# Altium schematic sheet SiP.SchDoc: Magic Baton: SiP
size Letter
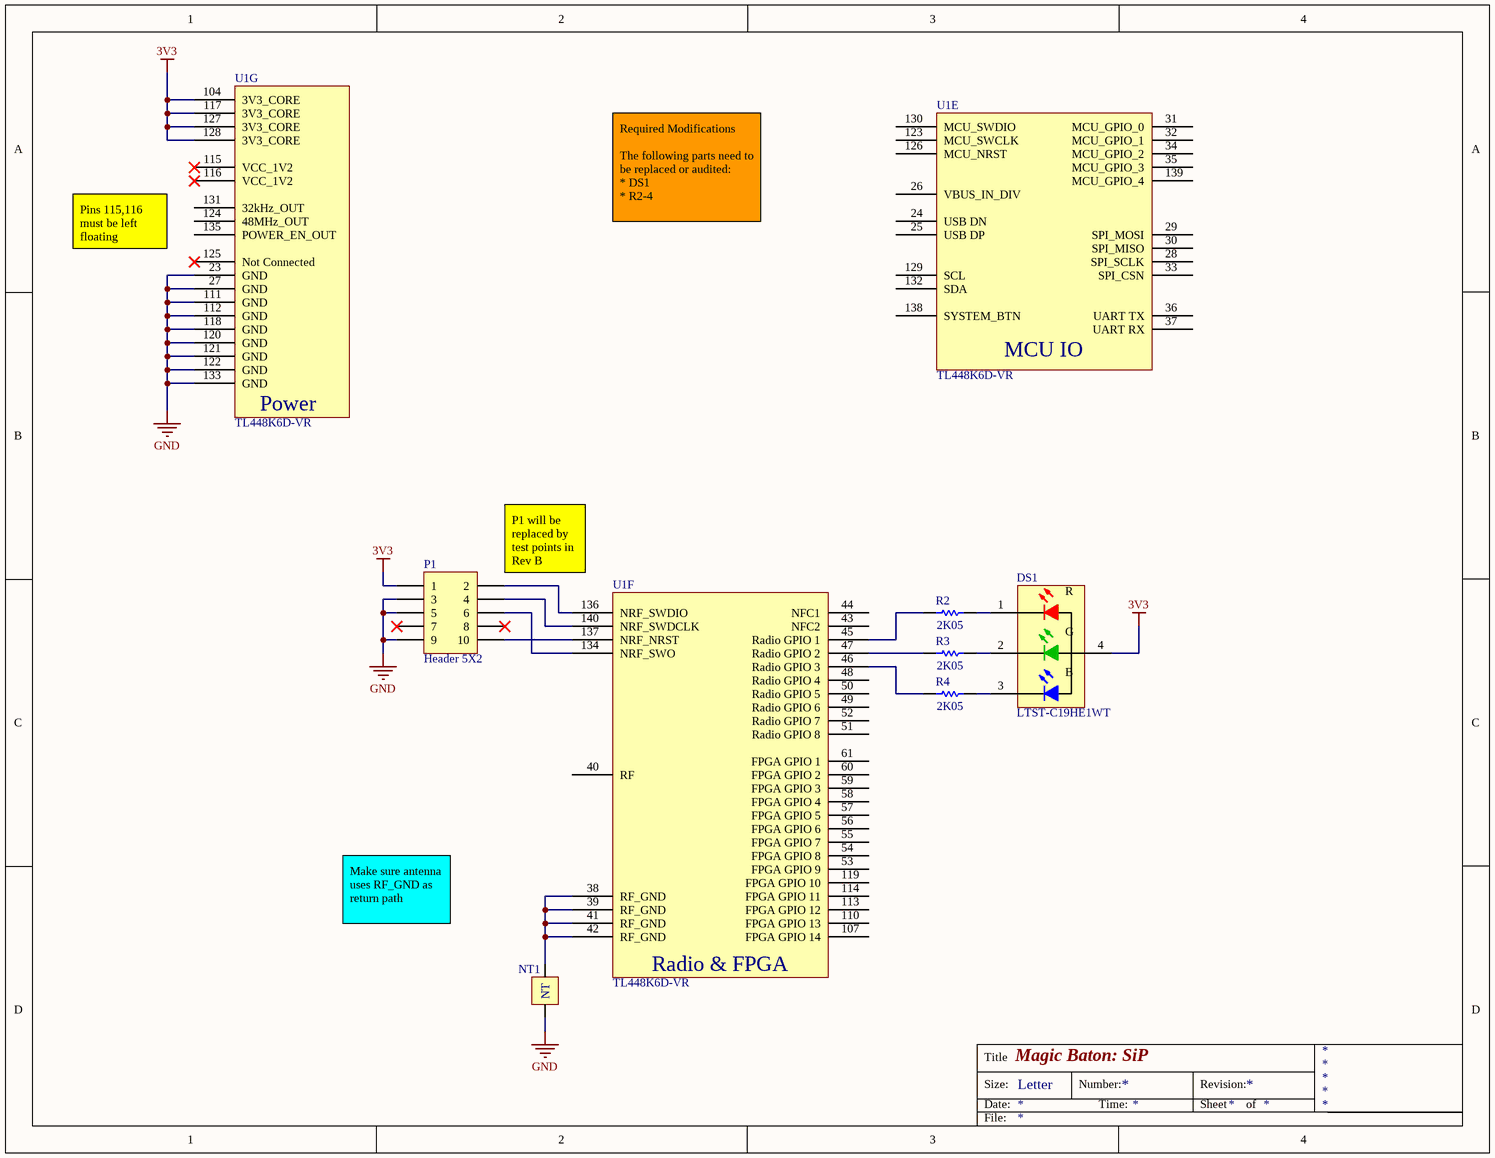
[diagram p0: SiP.SchDoc]

## Parts
DS1  LTST-C19HE1WT  [LTST-C19HE1WT-4_V]
NT1  NT1  (value not drawn)  (net tie, no BOM)
P1  Header 5X2  [HDR2X5]
R2  value 2K05  [AXIAL-0.3]  (hidden comment: Res1)
R3  value 2K05  [AXIAL-0.3]  (hidden comment: Res1)
R4  value 2K05  [AXIAL-0.3]  (hidden comment: Res1)
U1  TL448K6D-VR  [WatchmanModule_v4]  (parts E,F,G of 7)

## Nets
3V3: DS1.4(A) P1.1 U1.104(3V3_CORE) U1.117(3V3_CORE) U1.127(3V3_CORE) U1.128(3V3_CORE)
GND: NT1.1 P1.3 P1.5 P1.9 U1.23(GND) U1.27(GND) U1.111(GND) U1.112(GND) U1.118(GND) U1.120(GND) U1.121(GND) U1.122(GND) U1.133(GND)
NetDS1_1: DS1.1(R) R2.2
NetDS1_2: DS1.2(G) R3.2
NetDS1_3: DS1.3(B) R4.2
NetNT1_2: NT1.2 U1.38(RF_GND) U1.39(RF_GND) U1.41(RF_GND) U1.42(RF_GND)
NetP1_2: P1.2 U1.136(NRF_SWDIO)
NetP1_4: P1.4 U1.140(NRF_SWDCLK)
NetP1_6: P1.6 U1.134(NRF_SWO)
NetP1_10: P1.10 U1.137(NRF_NRST)
NetR2_1: R2.1 U1.45(Radio_GPIO_1)
NetR3_1: R3.1 U1.47(Radio_GPIO_2)
NetR4_1: R4.1 U1.46(Radio_GPIO_3)

Not connected (* = marked no-connect by the designer): P1 7* 8*; U1 24(USB_DN) 25(USB_DP) 26(VBUS_IN_DIV) 28(SPI_SCLK) 29(SPI_MOSI) 30(SPI_MISO) 31(MCU_GPIO_0) 32(MCU_GPIO_1) 33(SPI_CSN) 34(MCU_GPIO_2) 35(MCU_GPIO_3) 36(UART_TX) 37(UART_RX) 40(RF) 43(NFC2) 44(NFC1) 48(Radio_GPIO_4) 49(Radio_GPIO_6) 50(Radio_GPIO_5) 51(Radio_GPIO_8) 52(Radio_GPIO_7) 53(FPGA_GPIO_9) 54(FPGA_GPIO_8) 55(FPGA_GPIO_7) 56(FPGA_GPIO_6) 57(FPGA_GPIO_5) 58(FPGA_GPIO_4) 59(FPGA_GPIO_3) 60(FPGA_GPIO_2) 61(FPGA_GPIO_1) 107(FPGA_GPIO_14) 110(FPGA_GPIO_13) 113(FPGA_GPIO_12) 114(FPGA_GPIO_11) 115(VCC_1V2)* 116(VCC_1V2)* 119(FPGA_GPIO_10) 123(MCU_SWCLK) 124(48MHz_OUT) 125(Not_Connected)* 126(MCU_NRST) 129(SCL) 130(MCU_SWDIO) 131(32kHz_OUT) 132(SDA) 135(POWER_EN_OUT) 138(SYSTEM_BTN) 139(MCU_GPIO_4)

## Notes on the sheet
- Required Modifications
  The following parts need to be replaced or audited:
  * DS1
  * R2-4
- Pins 115,116 must be left floating
- P1 will be replaced by test points in Rev B
- Make sure antenna uses RF_GND as return path
- Title
- Size:
- Date:
- Letter
- Number:
- Time:
- Revision:
- Sheet
- of
- File:
- (in symbol NT1) NT
- (in symbol TL448K6D-VR, part E) MCU IO
- (in symbol TL448K6D-VR, part F) Radio & FPGA
- (in symbol TL448K6D-VR, part G) Power

## Library data of the parts
DS1 = CMP-2000-05201-1: LED Tri-Color Blue/Green/Red, 5 V, -20 to 80 degC, 4-Pin SMD, RoHS, Tape and Reel; Manufacturer: Lite-On; Viewing Angle: 130deg; Forward Voltage: 2.4(Red)V,3.9(Blue)V,3.9(Green)V; Lens Shape: Rectangle; LED Material: AlInGaP(Red),InGaN(Blue),InGaN(Green); Dominant Wavelength: 470/525/624nm; Luminous Intensity: 180mcd,450mcd; Number of LEDs: 3; LED Colours: Blue,Green,Red; Lens Colour: Clear; Number of Pins: 3; Series: LTST; Mounting Type: SurfaceMount; Datasheet URL: http://download.siliconexpert.com/pdfs/2014/3/25/6/41/6/148/lot_/manual/s_110_ltst-c19he1wt.pdf; Manufacturer URL: http://www.us.liteon.com/; Datasheet Version: Rev. B, 10/2013; Dimensions: 1.6x1.6x0.35mm
NT1 = NT1: Nettie
P1 = Header 5X2: Header, 5-Pin, Dual row; LatestRevisionDate: 17-Jul-2002; LatestRevisionNote: Re-released for DXP Platform.; Publisher: Altium Limited
R2-R4 = Res1: Resistor; Published: 8-Jun-2000; LatestRevisionDate: 17-Jul-2002; LatestRevisionNote: Re-released for DXP Platform.; PackageReference: AXIAL-0.3; Publisher: Altium Limited; PackageDescription: Axial Device, Thru-Hole; 2 Leads; 0.3 in Pin Spacing